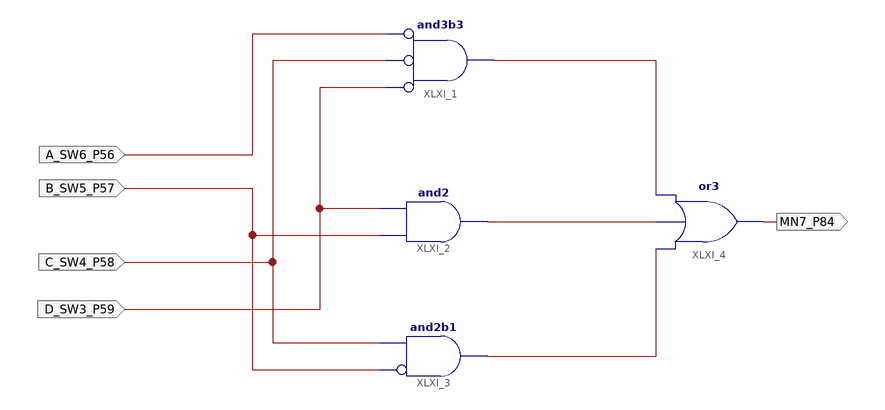
[diagram p0: schematic sheet 1]
// Xilinx ISE schematic Lab3.sch (spartan6) as structural Verilog: 4 symbols, 5 ports
module Lab3 (
  input  B_SW5_P57,
  input  C_SW4_P58,
  input  D_SW3_P59,
  input  A_SW6_P56,
  output MN7_P84
);

  wire XLXN_8, XLXN_9, XLXN_10;

  and XLXI_1 (XLXN_8, ~D_SW3_P59, ~C_SW4_P58, ~A_SW6_P56);  // and3b3
  and XLXI_2 (XLXN_9, B_SW5_P57, D_SW3_P59);
  and XLXI_3 (XLXN_10, ~B_SW5_P57, C_SW4_P58);  // and2b1
  or XLXI_4 (MN7_P84, XLXN_10, XLXN_9, XLXN_8);
endmodule
